# Altium schematic sheet sdcard.schdoc
size 143 x 86 mm
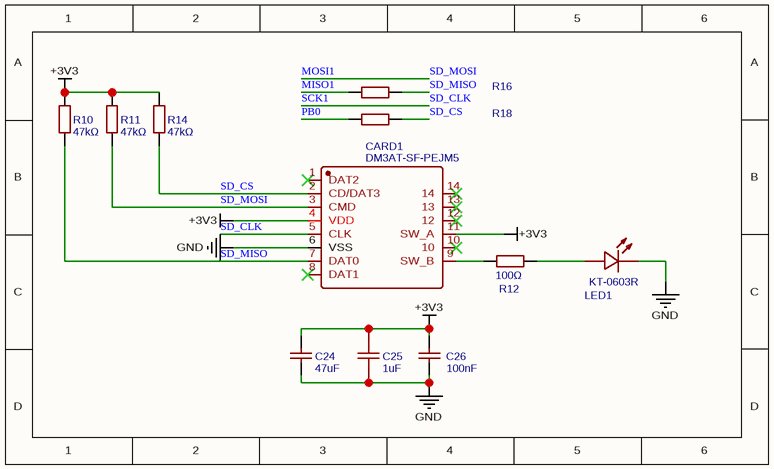
[diagram p0: sdcard.schdoc]

## Parts
C24  47uF  [C0805]
C25  1uF  [C0402]
C26  100nF  [C0402]
CARD1  DM3AT-SF-PEJM5  [SD-SMD_DM3AT-SF-PEJM5]
LED1  KT-0603R  [LED0603-RD]
R10  47kΩ  [R0402]
R11  47kΩ  [R0402]
R12  100Ω  [R0402]
R14  47kΩ  [R0402]
R16  22Ω  [R0402]  (value not drawn)
R18  22Ω  [R0402]  (value not drawn)

## Nets
+3V3: C24.1 C25.1 C26.2 CARD1.4(VDD) CARD1.11(SW_A) R10.1 R11.1 R14.1
GND: C24.2 C25.2 C26.1 CARD1.6(VSS) LED1.1(K)
MISO1: R16.1
MOSI1: CARD1.3(CMD) R11.2  [also labelled SD_MOSI]
PB0: R18.1
SCK1: CARD1.5(CLK)  [also labelled SD_CLK]
SD_CS: CARD1.2(CD/DAT3) R14.2 R18.2
SD_MISO: CARD1.7(DAT0) R10.2 R16.2
NetCARD1_9: CARD1.9(SW_B) R12.1
NetLED1_2: LED1.2(A) R12.2

Not connected (* = marked no-connect by the designer): CARD1 1(DAT2)* 8(DAT1)* 10* 12* 13* 14*

## Library data of the parts
C24 = 47uF: Manufacturer Part: CL21A476MQYNNNE; Manufacturer: SAMSUNG(三星); nameAlias: Value; Supplier: LCSC; Supplier Part: C16780; JLCPCB Part Class: Basic Part; spicePre: C; spiceSymbolName: CL21A476MQYNNNE
C25 = 1uF: Manufacturer: SAMSUNG(三星); Manufacturer Part: CL05A105KA5NQNC; nameAlias: Value; Supplier: LCSC; Supplier Part: C52923; JLCPCB Part Class: Basic Part; spicePre: C; spiceSymbolName: CL05A105KA5NQNC
C26 = 100nF: Manufacturer Part: CL05B104KO5NNNC; Manufacturer: SAMSUNG(三星); nameAlias: Value; Supplier: LCSC; Supplier Part: C1525; JLCPCB Part Class: Basic Part; spicePre: C; spiceSymbolName: CL05B104KO5NNNC
CARD1 = DM3AT-SF-PEJM5: Manufacturer: HRS(广濑); Contributor: LCSC; Supplier: LCSC; Supplier Part: C114218; Manufacturer Part: DM3AT-SF-PEJM5; JLCPCB Part Class: Extended Part; spicePre: C; spiceSymbolName: DM3AT-SF-PEJM5
LED1 = KT-0603R: Manufacturer: KENTO; Supplier: LCSC; Manufacturer Part: KT-0603R; Supplier Part: C2286; JLCPCB Part Class: Basic Part; spicePre: L; spiceSymbolName: KT-0603R
R10 R11 R14 = 47kΩ: Manufacturer: UNI-ROYAL(厚声); Manufacturer Part: 0402WGF4702TCE; nameAlias: Value; Supplier: LCSC; Supplier Part: C25792; JLCPCB Part Class: Basic Part; spicePre: R; spiceSymbolName: 0402WGF4702TCE
R12 = 100Ω: Manufacturer: UNI-ROYAL(厚声); Manufacturer Part: 0402WGF1000TCE; nameAlias: Value; Supplier: LCSC; Supplier Part: C25076; JLCPCB Part Class: Basic Part; spicePre: R; spiceSymbolName: 0402WGF1000TCE
R16 R18 = 22Ω: Manufacturer: UNI-ROYAL(厚声); Manufacturer Part: 0402WGF220JTCE; nameAlias: Value; Supplier: LCSC; Supplier Part: C25092; JLCPCB Part Class: Basic Part; spicePre: R; spiceSymbolName: 0402WGF220JTCE